# Altium project nest_jtag_serial.PrjPcb
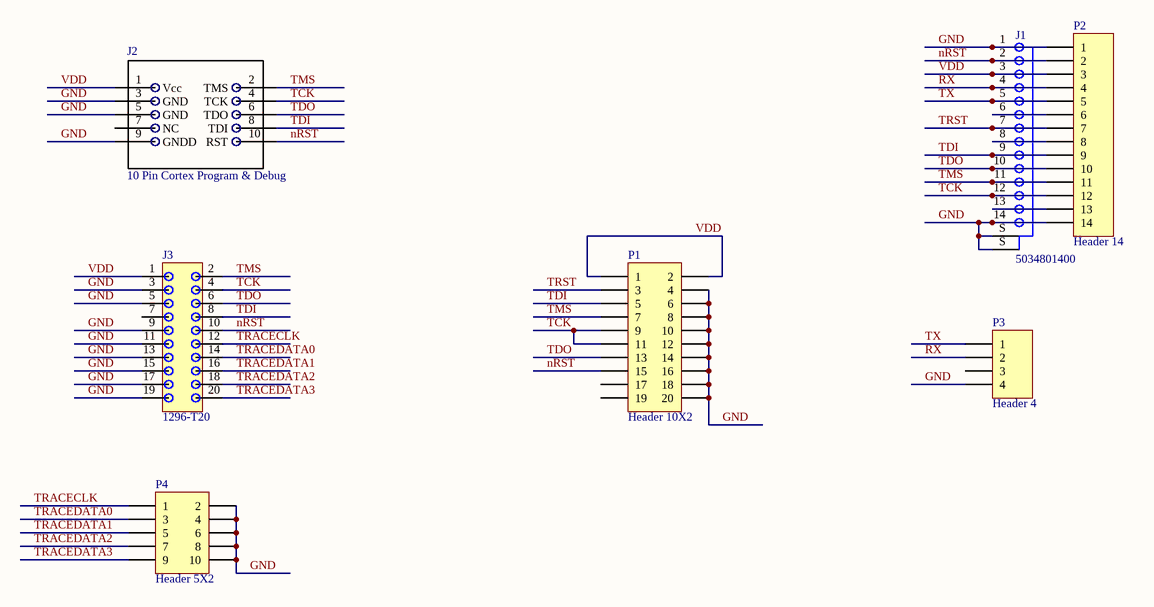
[diagram p0: nest_jtag_serial.SchDoc]
PrjLicense: <Select License>; PrjName: <Enter Project Name>; PrjRev: 00
1 sheet, 7 parts. Net scope: global (net labels, ports and power ports of the same name join across sheets).
Board file: nest_jtag_serial.PcbDoc

## Sheet nest_jtag_serial.SchDoc: <Enter Sheet Title>
size Letter; Organization: NewAE Technology Inc.; Address1: 1083 Queen St., Suite 196; Address2: Halifax; Address3: NS; Address4: Canada B3H 0B2; SheetApproved: NO

### Parts
J1  5034801400  [FFC_14pin_5034801400]
J2  10 Pin Cortex Program & Debug  [0.5mm_SMD_Header_5x2]
J3  1296-T20  [1296-T20]
P1  Header 10X2  [HDR2X10]
P2  Header 14  [HDR1X14]
P3  Header 4  [HDR1X4]
P4  Header 5X2  [HDR2X5]

### Nets
GND: J1.1 J1.14 J1.S(MNT) J2.3(GND) J2.5(GND) J2.9(GNDD) J3.3 J3.5 J3.9 J3.11 J3.13 J3.15 J3.17 J3.19 P1.4 P1.6 P1.8 P1.10 P1.12 P1.14 P1.16 P1.18 P1.20 P2.1 P2.14 P3.4 P4.2 P4.4 P4.6 P4.8 P4.10
nRST: J1.2 J2.10(RST) J3.10 P1.15 P2.2
RX: J1.4 P2.4 P3.2
TCK: J1.12 J2.4(TCK) J3.4 P1.9 P1.11 P2.12
TDI: J1.9 J2.8(TDI) J3.8 P1.5 P2.9
TDO: J1.10 J2.6(TDO) J3.6 P1.13 P2.10
TMS: J1.11 J2.2(TMS) J3.2 P1.7 P2.11
TRACECLK: J3.12 P4.1
TRACEDATA0: J3.14 P4.3
TRACEDATA1: J3.16 P4.5
TRACEDATA2: J3.18 P4.7
TRACEDATA3: J3.20 P4.9
TRST: J1.7 P1.3 P2.7
TX: J1.5 P2.5 P3.1
VDD: J1.3 J2.1(Vcc) J3.1 P1.1 P1.2 P2.3
NetJ1_6: J1.6 P2.6
NetJ1_8: J1.8 P2.8
NetJ1_13: J1.13 P2.13

Not connected (* = marked no-connect by the designer): J2 7(NC); J3 7; P1 17 19; P3 3

### Notes on the sheet
- Title:
- Date:
- Rev:
- Time:
- Project:
- Sheet
- of
- License:
- Copyright © NewAE Technology Inc.
- Approved:
- NewAE.com
- File:

### Library data of the parts
J1 = 5034801400: CONN FFC FPC 14POS 0.50MM R/A; Manufacture 1: Molex LLC; Component Group: Connector; PP Material Stack: 0; Part Number: 5034801400; Manufacture Part Number 1: 5034801400; Pin Count: 16; Supplier 1: Digi-Key; Supplier Part Number 1: WM1442CT-ND; Component Kind: Standard; Component Type: Standard; PP Rotation: 0
J2 = Cortex_Debug_Header_10Pin: 10 Pin Cortex Program & Debug 0.5mm pitch; Manufacture 1: Samtec Inc; Manufacture Part Number 1: FTSH-105-01-L-DV-007-K; Component Group: Connector; PP Material Stack: 0; Part Number: Cortex_Debug_Header_10Pin; Pin Count: 10; Supplier 1: Digi-Key; Supplier Part Number 1: SAM9438-ND; Mounting Technology: SMT; RoHS: Yes; Component Kind: Standard; Component Type: Standard; PP Rotation: 0
J3 = 1296-T20: Header, 20-pin, SMD, 0.05"; Component Group: Connector; Part Number: 1296-T20; Pin Count: 20; Mounting Technology: SMT; Component Kind: Standard; Component Type: Standard
P1 = Header 10X2: Header, 10-Pin, Dual row; LatestRevisionDate: 17-Jul-2002; LatestRevisionNote: Re-released for DXP Platform.; Publisher: Altium Limited
P2 = Header 14: Header, 14-Pin; LatestRevisionDate: 17-Jul-2002; LatestRevisionNote: Re-released for DXP Platform.; Publisher: Altium Limited
P3 = Header 4: Header, 4-Pin; LatestRevisionDate: 17-Jul-2002; LatestRevisionNote: Re-released for DXP Platform.; Publisher: Altium Limited
P4 = Header 5X2: Header, 5-Pin, Dual row; LatestRevisionDate: 17-Jul-2002; LatestRevisionNote: Re-released for DXP Platform.; Publisher: Altium Limited